# EasyEDA Pro project ProPrj_STM32音响_2025-06-08.epro, board Fourth Test
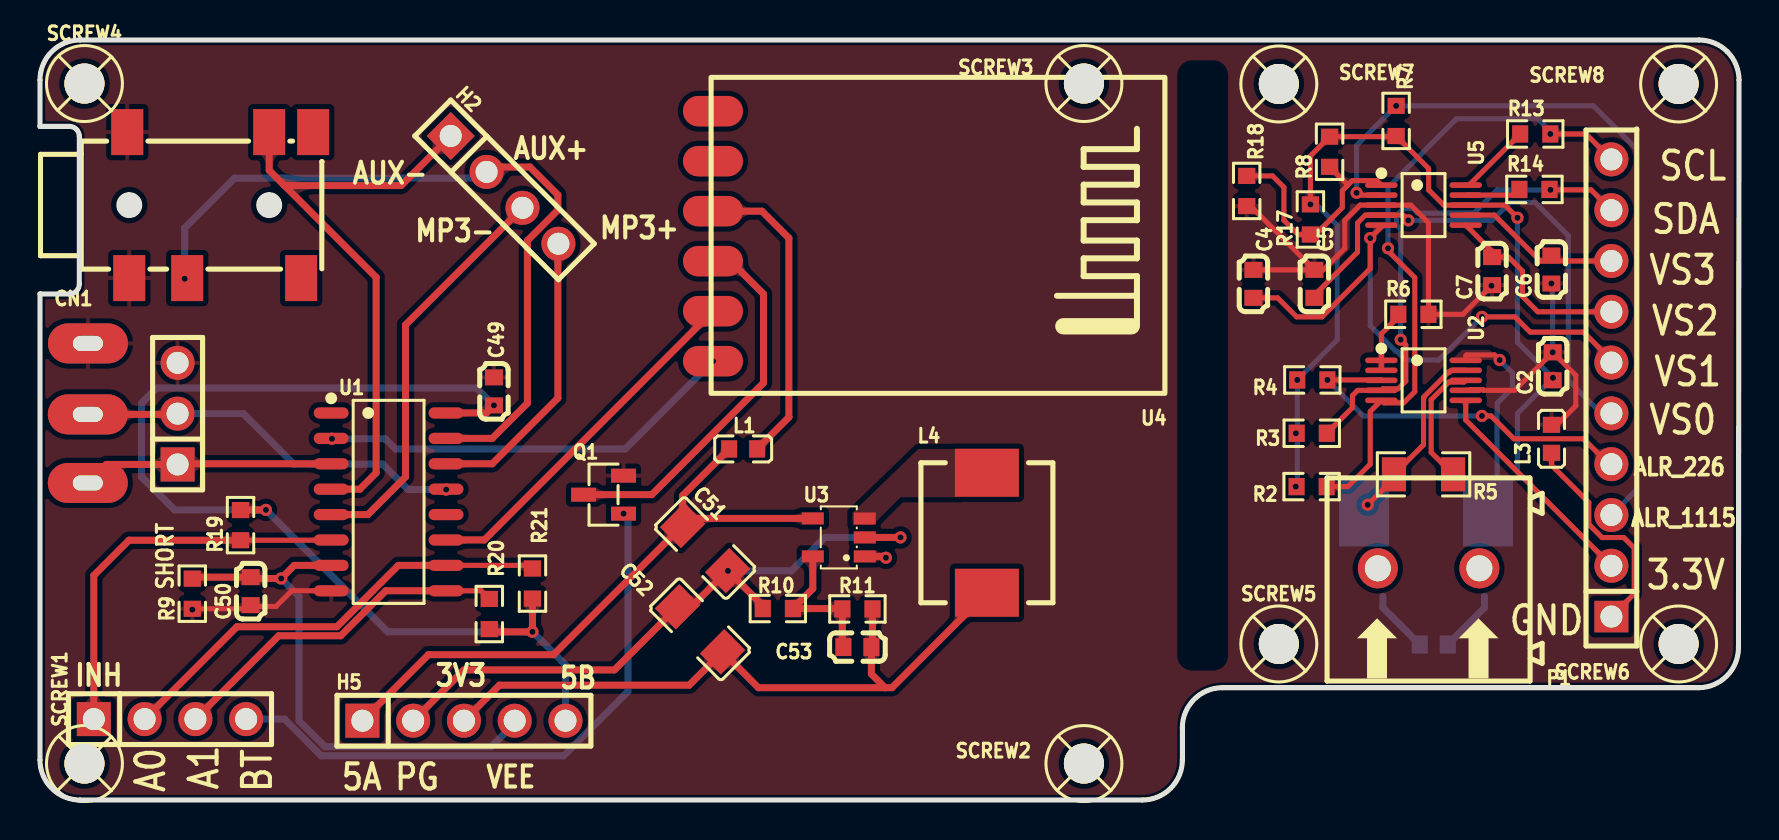
[diagram p21: board, top side]
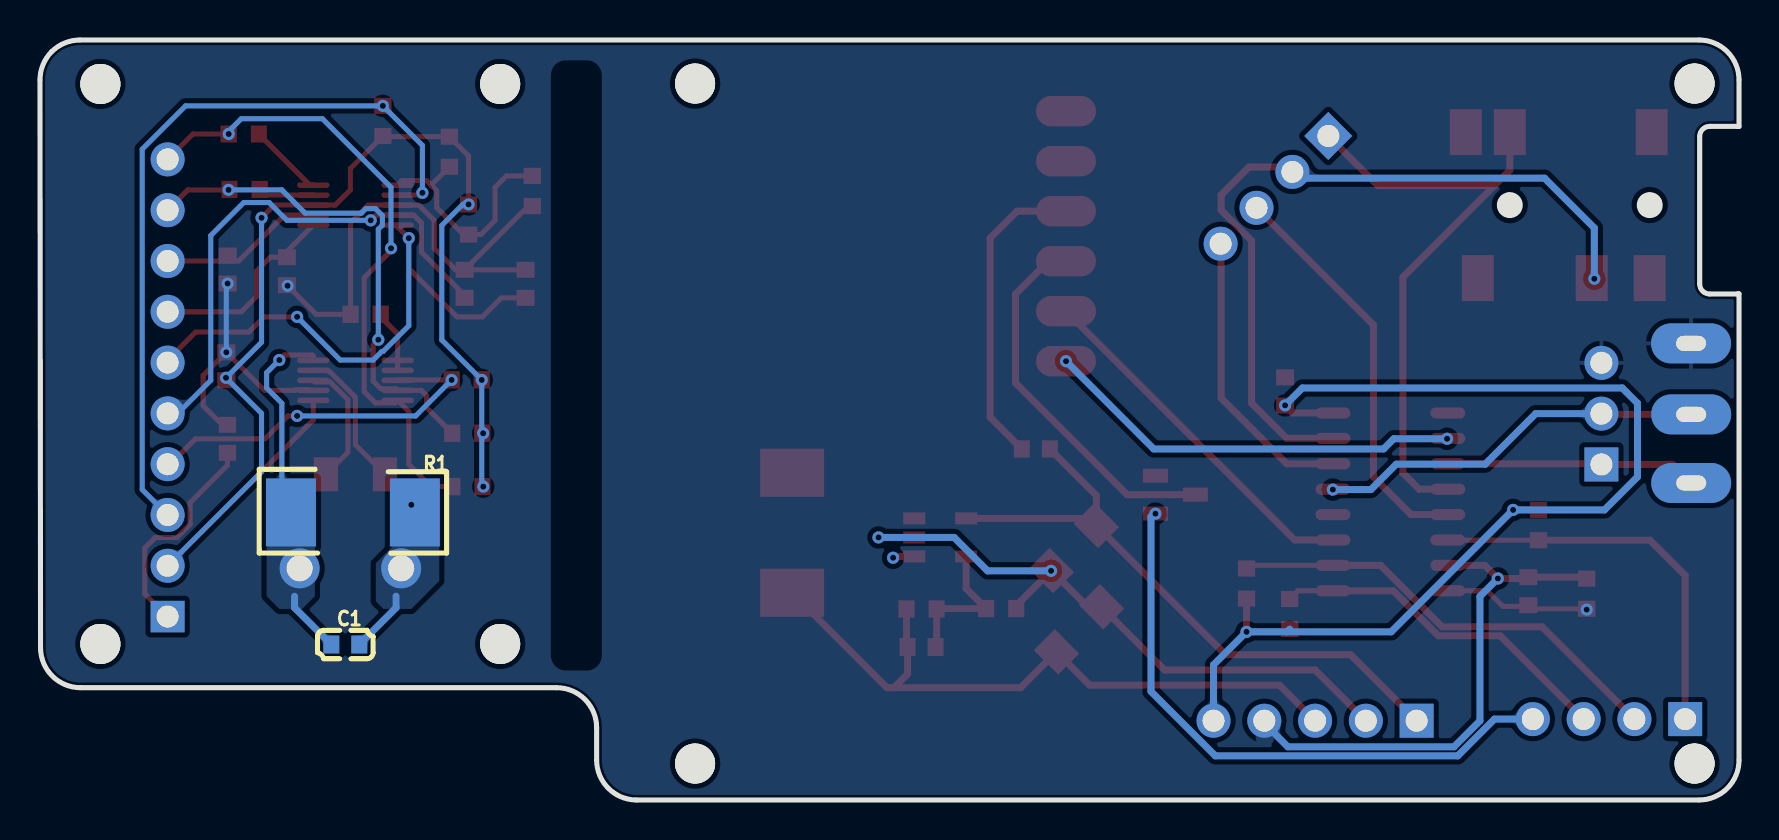
[diagram p22: board, bottom side, seen from below]

Outline 85 x 38 mm; copper layers: Top Layer, Bottom Layer. Coordinates in mm from the lower left corner of the outline.
Outline path: 0,36 arc(0.59,37.41) 2,38 83,38 arc(83.76,37.85) 84.41,37.41 arc(84.85,36.76) 85,36 84.97,7.61 arc(84.38,6.2) 82.97,5.61 59.15,5.61 arc(57.74,5.03) 57.15,3.61 57.15,2 arc(56.56,0.59) 55.15,0 2,0 arc(0.59,0.59) 0,2 0,25.3 arc(0.04,25.3) 0.07,25.3 1.47,25.3 arc(1.82,25.45) 1.97,25.8 1.97,33.18 arc(1.82,33.54) 1.47,33.68 0.07,33.68 arc(0.04,33.68) 0,33.68 0,36
Stack: Top Layer 0.035mm / Dielectric1 1.51mm FR4 er 4.5 / Bottom Layer 0.035mm

## Design rules (mm)
template: JLCPCB Capability(Two Layers Board)
spacing copperThickness1oz (default): track to track 0.102, other pairs 0.152 to 0.3
spacing copperThickness2oz: track to track 0.203, other pairs 0.152 to 0.3
track width copperThickness1oz (default): min 0.127, default 0.254, max 2.54
track width copperThickness2oz: min 0.203, default 0.254, max 2.54
differential pair differentialPair (default): width min 0.127, default 0.254, max 2.54; gap min 0.152, default 0.152
via viaSize (default): diameter min 0.5, default 0.61, max 10; hole min 0.3, default 0.305, max 6.3

## Placement (name value [footprint] x y rotation side)
C1  100nF  [C0603]  69.72 7.77 0 bottom
C2  100nF  [C0603]  75.68 21.69 90 top
C4  100nF  [C0603]  60.71 25.81 270 top
C5  100nF  [C0603]  63.75 25.81 270 top
C6  100nF  [C0603]  75.61 26.53 90 top
C7  100nF  [C0603]  72.64 26.44 90 top
C49  10nF  [C0603]  22.71 20.43 90 top
C50  10nF  [C0603]  10.54 10.44 90 top
C51  22uF  [C1206]  33.27 12.6 135 top
C52  22uF  [C1206]  33.02 8.54 135 top
C53  15pF  [C0603]  40.89 7.65 180 top
CN1  PJ-342  [AUDIO-SMD_PJ-342]  9.02 29.75 90 top
CN2  -  [长圆穿孔焊盘 4-2_1.5-0.75]  2.39 19.28 0 top
CN3  -  [长圆穿孔焊盘 4-2_1.5-0.75]  2.39 15.85 0 top
CN4  -  [长圆穿孔焊盘 4-2_1.5-0.75]  2.4 22.83 0 top
H1  PZ254V-11-10P  [HDR-TH_10P-P2.54-V-M]  78.61 20.6 90 top
H2  PZ254V-11-04P  [HDR-TH_4P-P2.54-V-M]  23.24 30.51 315 top
H5  PZ254V-11-05P  [HDR-TH_5P-P2.54-V-M]  21.21 3.96 0 top
H7  PZ254V-11-04P  [HDR-TH_4P-P2.54-V-M]  6.5 4.04 0 top
H9  PZ254V-11-03P  [HDR-TH_3P-P2.54-V-M]  6.89 19.32 90 top
L1  BLM18AG601SN1D  [L0603]  35.18 17.55 180 top
L3  BLM18AG601SN1D  [L0603]  75.62 18.06 90 top
L4  2.2uH  [IND-SMD_L7.0-W6.6]  47.37 13.36 90 top
P1  WJ500V-5.08-2P  [CONN-TH_2P-P5.00_WJ500V-5.08-2P]  69.47 11.58 180 top
Q1  AO3400C  [SOT-23-3_L2.9-W1.3-P1.90-LS2.4-BR]  28.19 15.27 0 top
R1  2mΩ  [RES-SMD_L6.4-W3.2-1]  69.34 14.38 0 bottom
R2  4.7kΩ  [R0603]  63.62 15.67 180 top
R3  4.7kΩ  [R0603]  63.62 18.34 180 top
R4  4.7kΩ  [R0603]  63.65 21 180 top
R5  0Ω  [R1206]  69.22 16.28 180 top
R6  2.2kΩ  [R0603]  68.71 24.28 0 top
R7  1kΩ  [R0603]  67.84 33.95 270 top
R8  1kΩ  [R0603]  64.52 32.41 90 top
R9  0Ω  [R0603]  7.62 10.31 90 top
R10  100kΩ  [R0603]  36.91 9.57 0 top
R11  450kΩ  [R0603]  40.89 9.55 180 top
R13  0Ω  [R0603]  74.8 33.3 0 top
R14  0Ω  [R0603]  74.76 30.53 0 top
R17  0Ω  [R0603]  63.56 29.03 90 top
R18  0Ω  [R0603]  60.37 30.45 270 top
R19  10kΩ  [R0603]  10.03 13.74 90 top
R20  10kΩ  [R0603]  22.48 9.3 90 top
R21  10kΩ  [R0603]  24.64 10.82 90 top
SCREW1  -  [M2螺丝]  2.22 1.82 0 top
SCREW2  -  [M2螺丝]  52.22 1.82 0 top
SCREW3  -  [M2螺丝]  52.22 35.82 0 top
SCREW4  -  [M2螺丝]  2.22 35.82 0 top
SCREW5  -  [M2螺丝]  61.98 7.8 0 top
SCREW6  -  [M2螺丝]  81.98 7.8 0 top
SCREW7  -  [M2螺丝]  61.98 35.8 0 top
SCREW8  -  [M2螺丝]  81.98 35.8 0 top
U1  CD4052BM/TR  [SOP-16_L10.0-W3.9-P1.27-LS6.0-BL]  17.44 14.91 270 top
U2  INA226AIDGSR  [MSOP-10_L3.0-W3.0-P0.50-LS5.0-BL]  69.22 20.98 270 top
U3  TLV62569DBVR  [SOT-23-5_L3.0-W1.7-P0.95-LS2.8-BR]  39.96 13.13 0 top
U4  -  [M18蓝牙接收器焊盘]  46.37 28.26 270 top
U5  ADS1115IDGSR  [MSOP-10_L3.0-W3.0-P0.50-LS5.0-BL]  69.22 29.75 270 top

## Footprints (pads in the part's own frame, mm; a bottom-side part is the same pattern mirrored in y, then rotated)
AUDIO-SMD_PJ-342
  rect 2.3x1.6 smd: 2(-3.65,4.55) 3(3.65,4.65) 4(-3.65,1.65) 5(3.65,-2.45) 6(-3.65,-4.05) 7(3.65,-4.65)
C0603
  rect 0.8x0.9 smd: 1(-0.7,0) 2(0.7,0)
C1206
  rect 1.485x1.728 smd: 1(-1.593,0) 2(1.593,0)
CONN-TH_2P-P5.00_WJ500V-5.08-2P
  round 2 hole 1.3: 1(-2.54,0) 2(2.54,0)
HDR-TH_3P-P2.54-V-M
  rect 1.7x1.7 hole 1.1: 1(-2.54,0)
  round 1.7 hole 1.1: 2(0,0) 3(2.54,0)
HDR-TH_4P-P2.54-V-M
  rect 1.7x1.7 hole 1.1: 1(-3.81,0)
  round 1.7 hole 1.1: 2(-1.27,0) 3(1.27,0) 4(3.81,0)
HDR-TH_5P-P2.54-V-M
  rect 1.7x1.7 hole 1.1: 1(-5.08,0)
  round 1.7 hole 1.1: 2(-2.54,0) 3(0,0) 4(2.54,0) 5(5.08,0)
HDR-TH_10P-P2.54-V-M
  rect 1.575x1.7 hole 1.1: 1(-11.43,0)
  round 1.7 hole 1.1: 2(-8.89,0) 3(-6.35,0) 4(-3.81,0) 5(-1.27,0) 6(1.27,0) 7(3.81,0) 8(6.35,0) 9(8.89,0) 10(11.43,0)
IND-SMD_L7.0-W6.6
  rect 2.4x3.2 smd: 1(-3,0) 2(3,0)
L0603
  rect 0.8x0.864 smd: 1(-0.7,0) 2(0.7,0)
M2螺丝
  round 2 hole 2: 1(0,0)
M18蓝牙接收器焊盘
  oval 1.524x3 smd: 1(-6.183,-12.7) 2(-3.683,-12.7) 3(-1.183,-12.7) 4(1.317,-12.7) 5(3.817,-12.7) 6(6.317,-12.7)
MSOP-10_L3.0-W3.0-P0.50-LS5.0-BL
  oval 0.28x1.62 smd: 1(-1,-2.11) 2(-0.5,-2.11) 3(0,-2.11) 4(0.5,-2.11) 5(1,-2.11) 6(1,2.11) 7(0.5,2.11) 8(0,2.11) 9(-0.5,2.11) 10(-1,2.11)
R0603
  rect 0.806x0.864 smd: 1(-0.753,0) 2(0.753,0)
R1206
  rect 1.208x1.701 smd: 1(-1.479,0) 2(1.479,0)
RES-SMD_L6.4-W3.2-1
  rect 2.5x3.4 smd: 1(-3.1,0) 2(3.1,0)
SOP-16_L10.0-W3.9-P1.27-LS6.0-BL
  oval 0.56x1.745 smd: 1(-4.445,-2.873) 2(-3.175,-2.873) 3(-1.905,-2.873) 4(-0.635,-2.873) 5(0.635,-2.873) 6(1.905,-2.873) 7(3.175,-2.873) 8(4.445,-2.873) 9(4.445,2.873) 10(3.175,2.873) 11(1.905,2.873) 12(0.635,2.873) 13(-0.635,2.873) 14(-1.905,2.873) 15(-3.175,2.873) 16(-4.445,2.873)
SOT-23-3_L2.9-W1.3-P1.90-LS2.4-BR
  rect 1.25x0.7 smd: 1(1,-0.95) 2(1,0.95) 3(-1,0)
SOT-23-5_L3.0-W1.7-P0.95-LS2.8-BR
  rect 1.1x0.6 smd: 1(1.3,-0.95) 2(1.3,0) 3(1.3,0.95) 4(-1.3,0.95) 5(-1.3,-0.95)
长圆穿孔焊盘 4-2_1.5-0.75
  oval 4x2 hole 1.5x0.75: 1(0,0)

## Nets
As in the schematic.

Pads without a net: CN1 6 7; SCREW1 1; SCREW2 1; SCREW3 1; SCREW4 1; SCREW5 1; SCREW6 1; SCREW7 1; SCREW8 1; U1 1 12; U4 1 2

## Via types
v1: diameter 0.61, hole 0.305, Top Layer to Bottom Layer, 35 vias

## Routing (per net, layer and track width the routed paths; a pad name or vN(x,y) marks a point on that pad's centre or on a via; arc(x,y) is an arc through that point)
+3.3V: length 97.9
  Top Layer w0.254: H1.2 71.32,19 U2.6 ; v1(63.56,29.78) 63.56,32.2 R8.2 67.81,33.17 R7.2 69.47,31.58 69.47,30.51 70.23,29.75 U5.8 73.28,29.75 v1(73.91,29.11)
  Top Layer w0.35: L4.1 42.62,5.61 42.28,5.61 ; 42.28,5.61 35.94,5.61 C52.1 32.48,5.74 22.99,5.74 H5.3 ; 42.28,5.61 41.59,6.3 C53.1 41.65,7.7 R11.1
  Bottom Layer w0.254: v1(62.82,15.67) 62.9,15.75 v1(62.9,21) 64.9,23 64.9,28.73 63.85,29.78 v1(63.56,29.78) ; H1.2 73.91,16.41 73.91,19.33 v1(75.69,21.11) 73.91,22.89 v1(73.91,29.11)
  vias: v1(62.83,18.34)
+5V_A: length 31.5
  Top Layer w0.35: H5.1 19.43,7.27 25.69,7.27 C51.2 ; C51.2 32.15,15.22 L1.2 ; C51.2 32.5,14.08 U3.4
+5V_B: length 57.9
  Top Layer w0.35: R19.2 10.04,14.5 v1(11.3,14.5) ; R21.1 v1(24.64,8.41) 22.61,8.41 R20.1 ; U1.16 22.33,19.35 v1(22.71,19.73)
  Bottom Layer w0.35: 22.61,8.41 17.4,8.41 v1(11.3,14.5) 6.73,14.5 5.08,16.16 5.08,19.84 5.84,20.6 21.84,20.6 22.73,19.71 ; 22.61,8.41 v1(24.64,8.41) 26.29,6.76 26.29,3.84 ; 22.61,8.41 R20.1
AGND: length 45.3
  Top Layer w0.254: L3.2 75.88,18.76 76.84,19.71 76.84,21.23 v1(75.68,22.39) 73.77,20.48 72.22,20.48 72.19,20.52 71.58,20.52 71.54,20.48 U2.7 ; 60.45,26.51 C5.1 ; C5.1 64.2,26.51 65.28,27.59 65.28,28.98 66.04,29.75 U5.3 68.58,29.75 69.46,28.86 R6.2 71.19,24.28 v1(72.61,25.71) ; C5.1 60.56,29.7 R18.2 ; R9.1 10.36,9.56 C50.1 10.6,9.68 11.81,9.68 12.59,10.46 U1.8
  Bottom Layer w0.254: v1(75.61,25.83) 75.68,25.76 v1(75.68,22.39)
  vias: v1(7.62,9.52)
GND: length 32.6
  Top Layer w0.35: R10.1 36.16,9.71 C51.1 32.59,9.66 C52.2 28.74,6.5 21.21,6.5 H5.2 ; U3.2 v1(43.05,13.13)
  Bottom Layer w0.35: v1(34.42,11.46) 37.59,11.46 39.26,13.13 v1(43.05,13.13)
VEE: length 26.6
  Top Layer w0.35: U1.7 12.72,11.73 v1(12.06,11.08) 10.61,11.08 C50.2 7.69,11.14 R9.2
  Bottom Layer w0.35: v1(12.06,11.08) 12.96,10.18 12.96,3.96 14.26,2.66 22.57,2.66 23.75,3.84
VIN+: length 13.6
  Top Layer w0.254: U2.10 71.32,22.2 71.37,22.25 72.77,22.25 v1(73.03,22)
  Bottom Layer w0.254: R1.2 72.9,14.83 72.9,19.84 73.66,20.6 73.66,21.36 v1(73.03,22)
  Bottom Layer w0.35: C1.2 72.26,9.61 72.26,10.19
VIN-: length 12.4
  Top Layer w0.254: U2.9 70.6,21.48 70.52,21.4 70.48,21.4 69.24,20.16 69.24,20.12 69.22,20.09 69.22,17.76 R5.2 67.74,16.07 v1(66.42,14.76)
  Bottom Layer w0.35: 67.18,10.19 67.18,9.61 69.02,7.77
A0: length 22.7
  Top Layer w0.254: U1.10 24.48,11.73 R21.2
  Top Layer w0.35: H7.2 9.85,8.66 14.86,8.66 17.93,11.73 U1.10
A1: length 17.5
  Top Layer w0.254: U1.9 22.07,10.46 R20.2
  Top Layer w0.35: U1.9 17.3,10.46 15.05,8.21 11.94,8.21 H7.3
ADDR: length 11.9
  Top Layer w0.254: 65.43,30.75 65.65,30.97 66.88,30.97 U5.1 ; R8.1 65.43,30.75 65.15,30.47 65.15,29.62 63.81,28.27 62.94,28.27 62.23,28.98 62.23,30.63 61.66,31.2 R18.1
AIN0: length 26.6
  Top Layer w0.254: C5.2 63.75,25.23 65.91,27.39 65.91,28.86 66.3,29.25 U5.4 68.19,29.25 v1(68.45,28.98)
  Bottom Layer w0.254: v1(68.45,28.98) 72.64,28.98 73.53,29.87 74.8,29.87 76.45,28.22 76.45,20.98 78.1,19.33 H1.5
AIN1: length 28.7
  Top Layer w0.254: U5.5 67.1,28.65 v1(66.55,28.09) 66.55,26.57 64.13,24.16 62.87,24.16 61.91,25.11 C4.2 ; v1(72.14,24.16) 73.79,24.16 74.55,23.39 77.22,23.39 78.61,22 H1.6
  Bottom Layer w0.254: v1(72.14,24.16) 69.98,22 68.33,22 67.89,22.43 67.83,22.43 66.55,23.71 v1(66.55,28.09)
AIN2: length 10
  Top Layer w0.254: H1.7 74.93,24.41 74.17,25.17 74.17,26.44 73.47,27.14 C7.2 72.64,27.43 U5.6
AIN3: length 8.2
  Top Layer w0.254: U5.7 72.76,29.25 75.06,26.95 H1.8
ALERT_226: length 18.7
  Top Layer w0.254: U2.3 67.08,21 v1(64.4,21) ; v1(72.14,19.2) 72.59,19.2 73.74,18.06 77.22,18.06 78.49,16.79 H1.4
  Bottom Layer w0.254: v1(64.4,21) 66.2,19.2 v1(72.14,19.2)
ALERT_1115: length 38.2
  Top Layer w0.254: v1(65.87,30.36) 65.98,30.25 U5.2
  Bottom Layer w0.254: H1.3 79.88,15.52 79.88,32.54 77.72,34.71 v1(67.84,34.71) 65.87,32.73 v1(65.87,30.36)
AUX+: length 38.9
  Top Layer w0.35: 22.34,31.41 22.59,31.65 24.51,31.65 25.91,30.25 25.91,29.49 24.38,27.97 24.38,19.84 22.63,18.08 U1.15
  Bottom Layer w0.35: v1(7.24,26.06) 7.24,28.6 9.73,31.09 22.03,31.09 22.34,31.41
AUX-: length 31.2
  Top Layer w0.35: U1.4 16,15.54 16.82,16.36 16.82,26.14 12.23,30.72 ; CN1.5 11.47,31.49 12.23,30.72 ; 20.55,33.2 18.07,30.72 12.23,30.72
BT+: length 18.1
  Top Layer w0.35: U1.11 22.23,13 U4.5
BT-: length 21.1
  Bottom Layer w0.35: v1(14.61,18.06) 17.27,18.06 17.78,17.55 29.28,17.55 v1(33.67,21.94)
BT_SW: length 30.2
  Bottom Layer w0.35: H7.4 12.23,4.04 14.07,2.21 26.2,2.21 29.42,5.43 29.42,14.17 29.21,14.38
  vias: v1(29.19,14.32)
EN_TLV: length 1.1
  Top Layer w0.35: v1(42.32,12.11) 42.25,12.18 U3.1
INH#: length 19.8
  Top Layer w0.254: R19.1 14.56,12.99 U1.6
  Top Layer w0.35: R19.1 4.45,12.99 2.69,11.23 H7.1
MP3+: length 14.7
  Top Layer w0.35: U1.14 22.63,16.81 25.91,20.09 25.91,27.79 25.94,27.81
MP3-: length 20.4
  Top Layer w0.35: U1.5 16.4,14.27 18.29,16.16 18.29,23.76 H2.3
OUT+: length 19.5
  Top Layer w0.35: CN2.1 6.85,19.28 H9.2
  Bottom Layer w0.35: v1(20.32,15.52) 18.42,15.52 17.14,16.79 12.7,16.79 10.17,19.32 H9.2
OUT-: length 12.6
  Top Layer w0.35: CN3.1 3.32,16.78 H9.1 6.92,16.81 U1.3
SCL: length 32.2
  Top Layer w0.254: R2.1 65.43,15.67 66.55,16.79 66.55,19.42 U2.5 67.23,19.86 68.22,19.86 68.78,20.42 68.78,26.12 67.44,27.46 v1(67.44,27.59) ; 78.61,32.03 77.34,33.3 v1(75.56,33.3)
  Bottom Layer w0.254: v1(67.44,27.59) 67.44,30.63 70.87,34.06 74.93,34.06 75.56,33.43
SCL_O: length 3.8
  Top Layer w0.254: U5.10 71.49,30.75 R13.1
SDA: length 25.7
  Top Layer w0.254: H1.9 77.6,30.51 v1(75.56,30.51) ; R3.1 65.66,19.62 65.66,20.22 65.92,20.48 U2.4 67.19,20.56 67.95,20.56 68.33,20.94 68.33,22.76 v1(68.07,23.01)
  Bottom Layer w0.254: v1(68.07,23.01) 68.07,28.54 67.87,28.74 67.87,29.22 68.21,29.57 68.69,29.57 68.92,29.34 71.73,29.34 72.9,30.51 v1(75.56,30.51)
SDA_O: length 2.8
  Top Layer w0.254: U5.9 73.73,30.25 R14.1
$1N964: length 6.3
  Top Layer w0.254: R5.1 69.6,17.38 69.6,20.02 70.48,20.9 71.24,20.9 U2.8
$1N970: length 3.4
  Top Layer w0.254: 68.21,24.41 67.1,23.31 U2.1 U2.2
$1N983: length 11
  Top Layer w0.254: L3.1 75.62,16.74 77.48,14.87 77.48,13.78 78.15,13.12 79.23,13.12 79.76,12.6 79.76,10.31 H1.1
$3N1532: length 15.6
  Top Layer w0.35: L1.1 37.47,19.14 37.47,28.09 36.12,29.44 U4.3
$3N2020: length 7.4
  Top Layer w0.35: U3.5 38.66,10.57 R10.2 40.12,9.57 R11.2 40.14,7.7 C53.2
$3N7759: length 19
  Top Layer w0.35: Q1.3 30.61,15.27 36.19,20.86 36.19,25.3 34.55,26.94 U4.4

## Copper pours and planes (outline as drawn; the poured copper is in the pictures)
AGND on Top Layer: 0,36 0.59,37.41 2,38 83,38 84.41,37.41 85,36 84.97,7.61 84.38,6.2 82.97,5.61 59.15,5.61 57.74,5.03 57.15,3.61 57.15,2 56.56,0.59 55.15,0 2,0 0.59,0.59 0,2
AGND on Bottom Layer: 0,36 0.59,37.41 2,38 83,38 84.41,37.41 85,36 84.97,7.61 84.38,6.2 82.97,5.61 59.15,5.61 57.74,5.03 57.15,3.61 57.15,2 56.56,0.59 55.15,0 2,0 0.59,0.59 0,2
VIN+ on Top Layer: 70.61,22.51 73.03,22.51 73.03,22 70.61,22
VIN+ on Bottom Layer: 71.2,12.73 73.66,12.73 73.66,9.55 71.2,9.55
VIN- on Bottom Layer: 65.02,12.73 68.2,12.73 68.2,9.55 65.02,9.55
$3N6590 on Top Layer: 40.64,17.55 46.03,17.55 46.03,13.74 40.64,13.74

Small or netless copper shapes (teardrops, artwork), in the pictures only: 150 on Top Layer, 44 on Bottom Layer

## Text on the board
Top Silkscreen Layer: SHORT | ALR_1115 | ALR_226 | INH | MP3- | VEE | AUX+ | 5B | MP3+ | AUX- | 3V3 | 5A | PG | GND | 3.3V | VS3 | VS0 | SDA | VS2 | VS1 | SCL | A0 | A1 | BT
